# EAGLE design MODULO_LEDS (EAGLE 7.5.0)
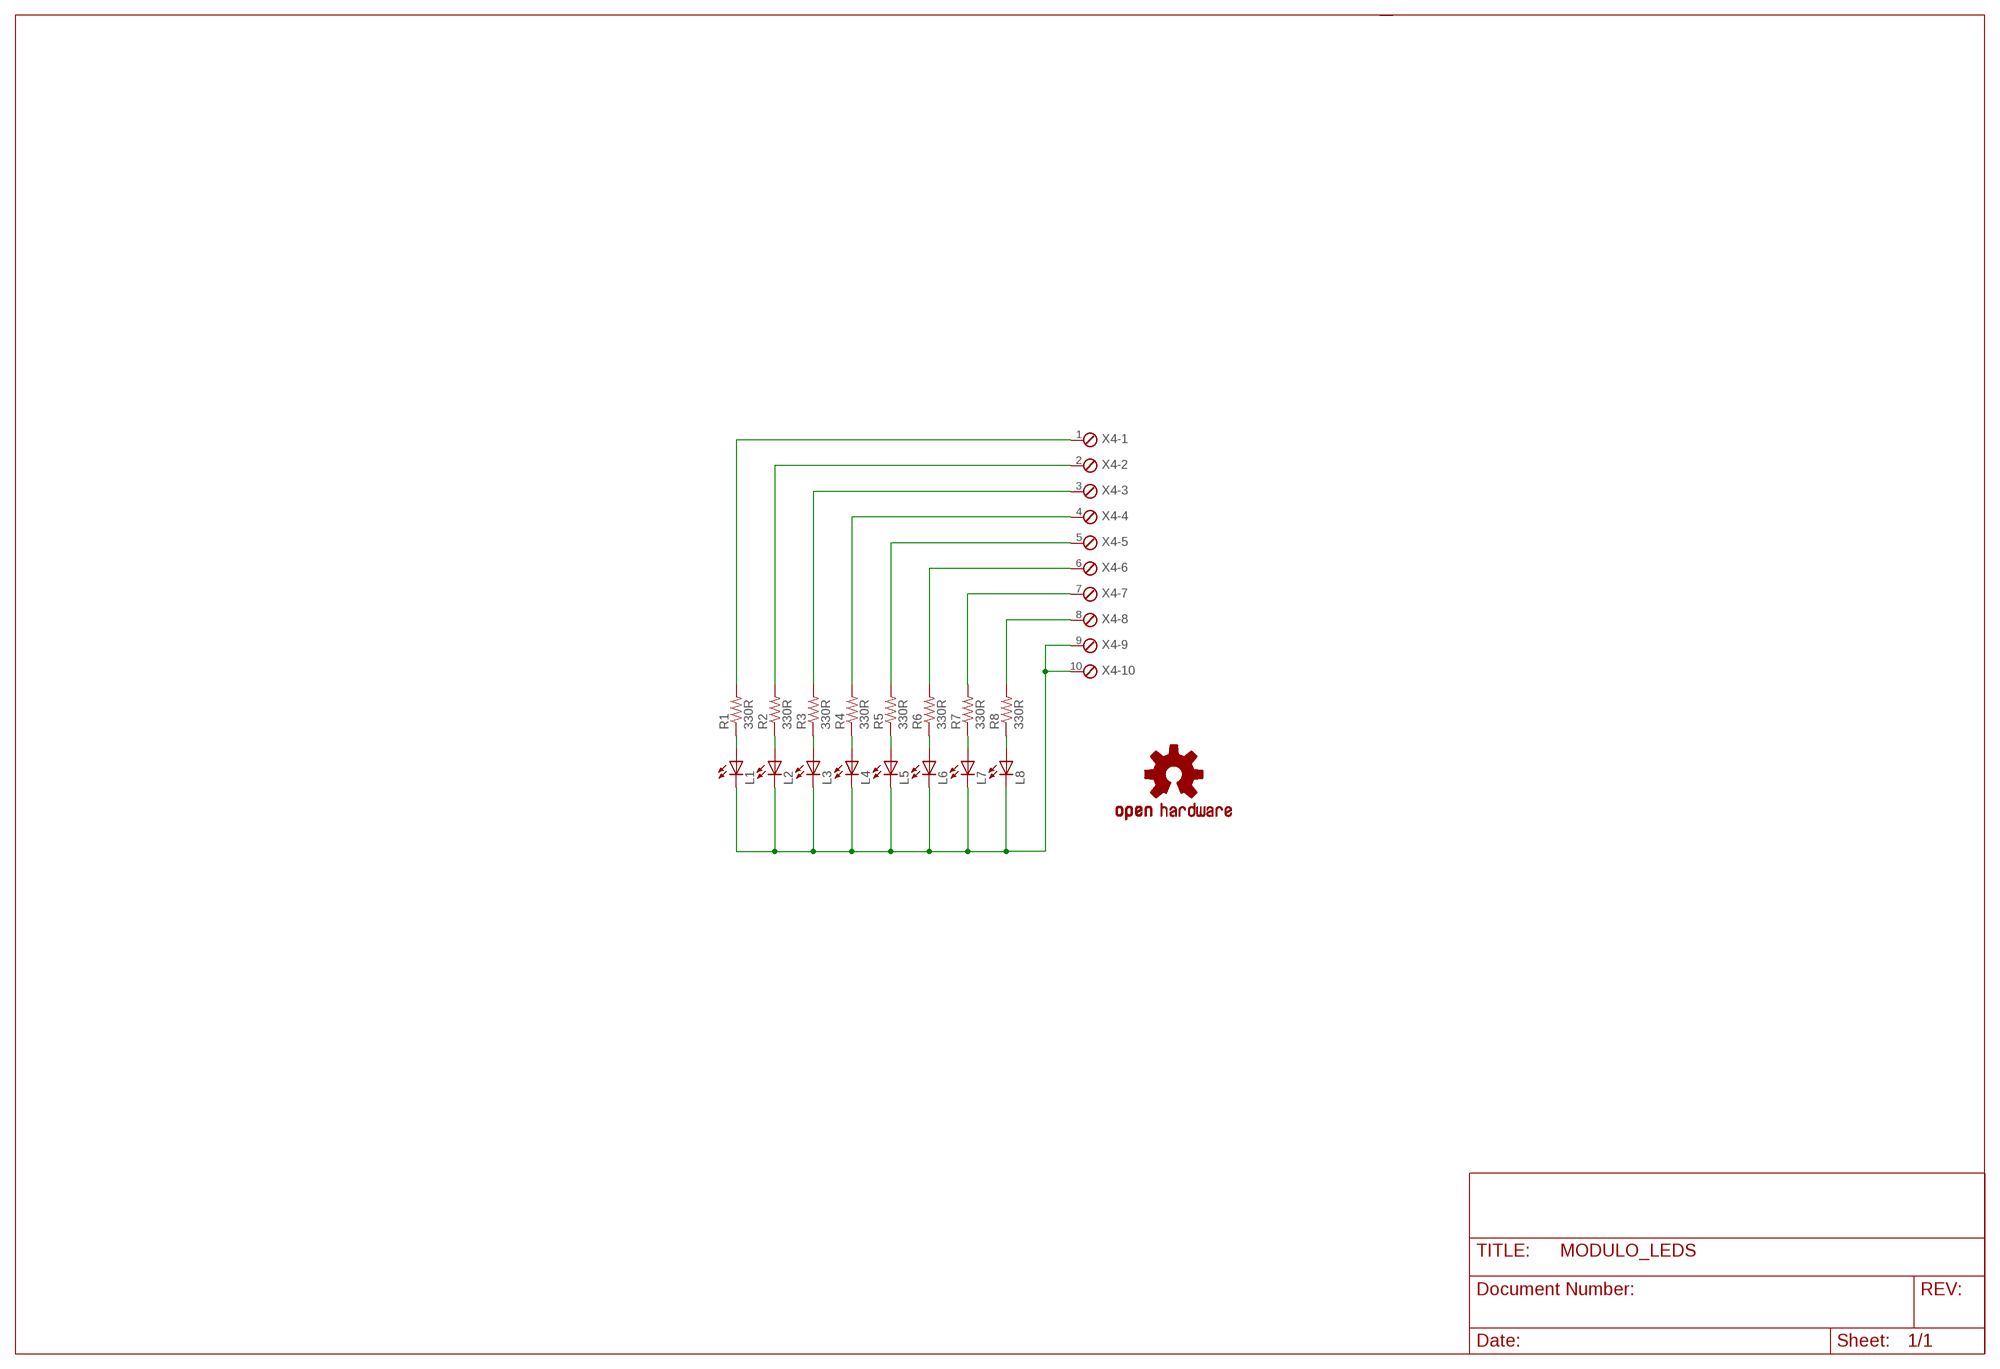
[diagram p0: schematic, sheet 1]

## Parts
L1  LED3MM  [LED3MM]
L2  LED3MM  [LED3MM]
L3  LED3MM  [LED3MM]
L4  LED3MM  [LED3MM]
L5  LED3MM  [LED3MM]
L6  LED3MM  [LED3MM]
L7  LED3MM  [LED3MM]
L8  LED3MM  [LED3MM]
LOGO1  OSHW-LOGOM  [OSHW-LOGO-M]
R1  330R  RESISTORPTH-1/4W  [AXIAL-0.4]
R2  330R  RESISTORPTH-1/4W  [AXIAL-0.4]
R3  330R  RESISTORPTH-1/4W  [AXIAL-0.4]
R4  330R  RESISTORPTH-1/4W  [AXIAL-0.4]
R5  330R  RESISTORPTH-1/4W  [AXIAL-0.4]
R6  330R  RESISTORPTH-1/4W  [AXIAL-0.4]
R7  330R  RESISTORPTH-1/4W  [AXIAL-0.4]
R8  330R  RESISTORPTH-1/4W  [AXIAL-0.4]
X4  MPT10  [10POL254]

## Nets
N$5: L1.A R1.P$1
N$6: L2.A R2.P$1
N$7: L3.A R3.P$1
N$8: L4.A R4.P$1
N$11: L1.K(C) L2.K(C) L3.K(C) L4.K(C) L5.K(C) L6.K(C) L7.K(C) L8.K(C) X4.9 X4.10
N$12: L5.A R5.P$1
N$13: L6.A R6.P$1
N$14: L7.A R7.P$1
N$15: L8.A R8.P$1
N$18: R1.P$2 X4.1
N$20: R2.P$2 X4.2
N$21: R3.P$2 X4.3
N$22: R4.P$2 X4.4
N$23: R5.P$2 X4.5
N$24: R6.P$2 X4.6
N$25: R7.P$2 X4.7
N$26: R8.P$2 X4.8

## Library data of the parts
L1-L8 = led:LED: LED OSRAM: - CHIPLED LG R971, LG N971, LY N971, LG Q971, LY Q971, LO R971, LY R971 LH N974, LH R974 LS Q976, LO Q976, LY Q976 LO Q996 - Hyper CHIPLED LW Q18S LB Q993, LB Q99A, LB R99A - SideLED LS A670, LO A670, LY A670, LG A670, LP A670 LB A673, LV A673, LT A673, LW A673 LH A674 LY A675 LS A676, LA A676, LO A676, LY A676, LW A676 LS A679, LY A679, LG A679 - Hyper Micro SIDELED® LS Y876, LA Y876, LO Y876, LY Y876 LT Y87S - SmartLED LW L88C, LW L88S LB L89C, LB L89S, LG L890 LS L89K, LO L89K, LY L89K LS L896, LA L896, LO L896, LY L896 - TOPLED LS T670, LO T670, LY T670, LG T670, LP T670 LSG T670, LSP T670, LSY T670, LOP T670, LYG T670 LG T671, LOG T671, LSG T671 LB T673, LV T673, LT T673, LW T673 LH T674 LS T676, LA T676, LO T676, LY T676, LB T676, LH T676, LSB T676, LW T676 LB T67C, LV T67C, LT T67C, LS T67K, LO T67K, LY T67K, LW E67C LS E67B, LA E67B, LO E67B, LY E67B, LB E67C, LV E67C, LT E67C LW T67C LS T679, LY T679, LG T679 LS T770, LO T770, LY T770, LG T770, LP T770 LB T773, LV T773, LT T773, LW T773 LH T774 LS E675, LA E675, LY E675, LS T675 LS T776, LA T776, LO T776, LY T776, LB T776 LHGB T686 LT T68C, LB T68C - Hyper Mini TOPLED® LB M676 - Mini TOPLED Santana® LG M470 LS M47K, LO M47K, LY M47K Source: http://www.osram.convergy.de LUXEON: - LUMILED® LXK2-PW12-R00, LXK2-PW12-S00, LXK2-PW14-U00, LXK2-PW14-V00 LXK2-PM12-R00, LXK2-PM12-S00, LXK2-PM14-U00 LXK2-PE12-Q00, LXK2-PE12-R00, LXK2-PE12-S00, LXK2-PE14-T00, LXK2-PE14-U00 LXK2-PB12-K00, LXK2-PB12-L00, LXK2-PB12-M00, LXK2-PB14-N00, LXK2-PB14-P00, LXK2-PB14-Q00 LXK2-PR12-L00, LXK2-PR12-M00, LXK2-PR14-Q00, LXK2-PR14-R00 LXK2-PD12-Q00, LXK2-PD12-R00, LXK2-PD12-S00 LXK2-PH12-R00, LXK2-PH12-S00 LXK2-PL12-P00, LXK2-PL12-Q00, LXK2-PL12-R00 Source: www.luxeon.com KINGBRIGHT: KA-3528ASYC Source: www.kingbright.com
LOGO1 = SparkFun-Aesthetics:OSHW-LOGO: Open Source Hardware Logo This logo indicates the piece of hardware it is found on incorporates a OSHW license and/or adheres to the definition of open source hardware found here: http://freedomdefined.org/OSHW
R1-R8 = SparkFun:RESISTOR: Resistor Basic schematic elements and footprints for 0603, 1206, and PTH resistors.
X4 = con-phoenix-254:MPT10: PHOENIX CONNECTOR; OC_FARNELL: unknown; OC_NEWARK: unknown

## Board
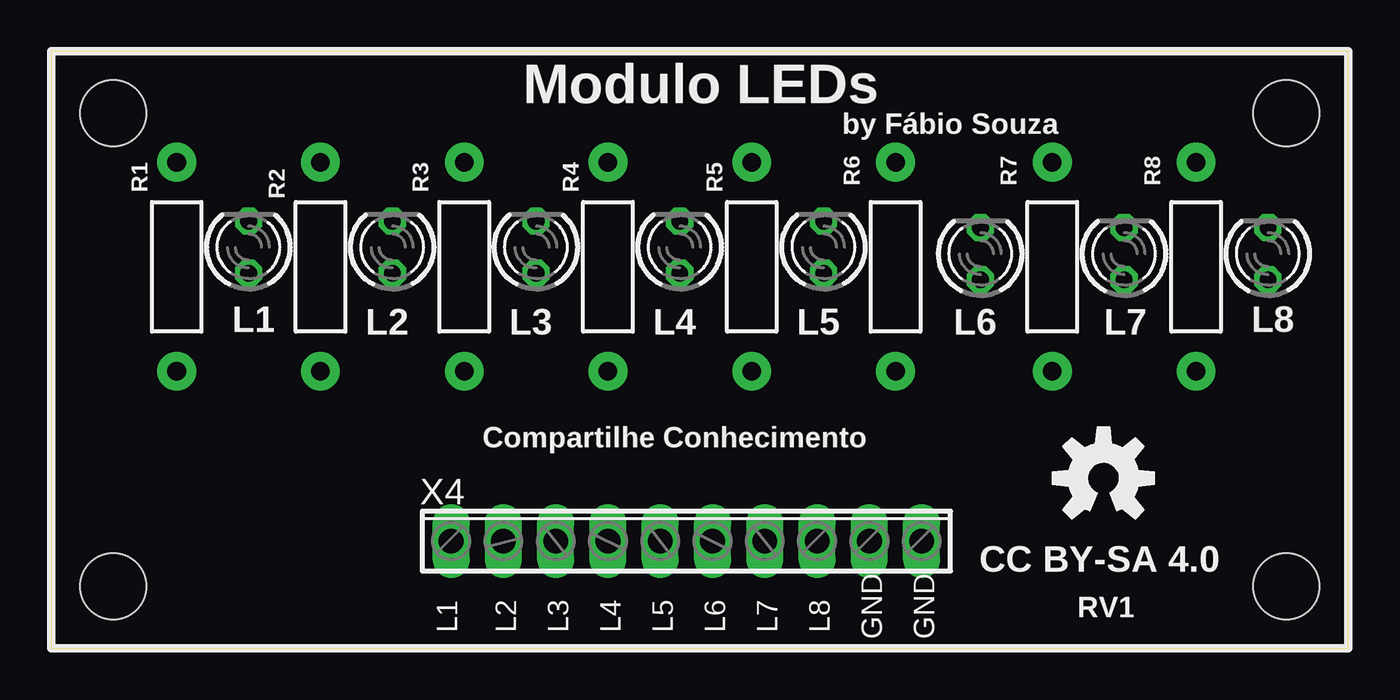
[diagram p1: board, top side]
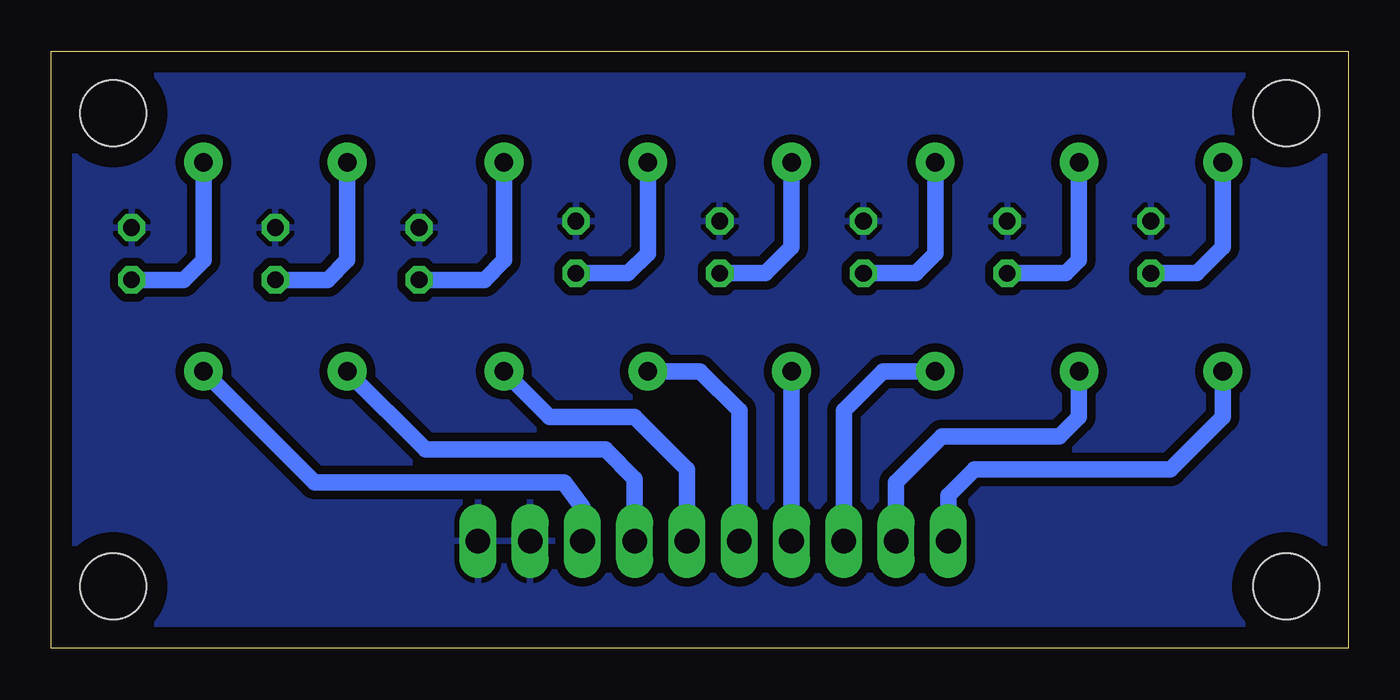
[diagram p2: board, bottom side, seen from below]

Size 63 x 29 mm. Coordinates in mm from the lower left corner, seen from the top.
Outline: 63,29 0,29 0,0 63,0 63,29
Copper layers (1*16): Top 0.035mm / dielectric 1.5mm / Bottom 0.035mm
Design rules "default": minimum track width 10mil, minimum drill 24mil, track to track 8mil, track to pad 8mil, pad to pad 8mil, via to via 8mil, smd to smd 8mil, copper to edge 40mil, drill to drill 8mil, minimum pad ring 10mil, minimum via ring 8mil, stop-mask expansion 4mil, vias tented up to drill 0mil, thermal gap 10mil
Holes 3.2 mm at 60,3 60,26 3,26 3,3

### Footprints (pad centres in the part's own frame; a part is rotated, then mirrored left to right if it is on the bottom)
LED3MM = drill 0.813 octagon: A -1.27,0; K 1.27,0
AXIAL-0.4 = drill 0.9 pad 1.88: P$1 -5.08,0; P$2 5.08,0
10POL254 = drill 1.2 long: 1 -11.43,0; 2 -8.89,0; 3 -6.35,0; 4 -3.81,0; 5 -1.27,0; 6 1.27,0; 7 3.81,0; 8 6.35,0; 9 8.89,0; 10 11.43,0

### Placement (x,y rotation side)
L1  9.58,19.49 90 top
L2  16.56,19.49 90 top
L3  23.55,19.49 90 top
L4  30.53,19.49 90 top
L5  37.52,19.49 90 top
L6  45.14,19.17 90 top
L7  52.12,19.17 90 top
L8  59.11,19.17 90 top
LOGO1  51.12,8.26 0 top
R1  6.08,18.54 270 top
R2  13.07,18.54 270 top
R3  20.05,18.54 270 top
R4  27.04,18.54 270 top
R5  34.02,18.54 270 top
R6  41.01,18.54 270 top
R7  48.63,18.54 270 top
R8  55.62,18.54 270 top
X4  30.85,5.2 0 top

### Tracks (layer width: path | path; a pad name or v marks a point on that pad's centre or on a via)
N$5
  Bottom 0.813: L1.A 7.36,18.22 6.08,19.49 R1.P$1
N$6
  Bottom 0.813: L2.A 13.71,18.22 13.07,18.85 R2.P$1
N$7
  Bottom 0.813: L3.A 21.01,18.22 20.05,19.17 R3.P$1
N$8
  Bottom 0.813: L4.A 28.31,18.22 27.04,19.49 R4.P$1
N$11
  pour Bottom (isolate 0.406): 62.6,28.7 0.37,28.7 0.37,0.12 62.92,0.44
N$12
  Bottom 0.813: L5.A 34.98,18.22 34.02,19.17 R5.P$1
N$13
  Bottom 0.813: L6.A 41.96,17.9 41.01,18.85 R6.P$1
N$14
  Bottom 0.813: L7.A 49.58,17.9 48.63,18.85 R7.P$1
N$15
  Bottom 0.813: L8.A 56.57,17.9 55.62,18.85 R8.P$1
N$18
  Bottom 0.813: X4.1 19.42,7.42 18.15,8.69 8.62,8.69 6.08,11.23 R1.P$2
N$20
  Bottom 0.813: X4.2 21.96,8.06 19.74,10.28 14.02,10.28 13.07,11.23 R2.P$2
N$21
  Bottom 0.813: X4.3 24.5,11.55 22.59,13.46 R3.P$2
N$22
  Bottom 0.813: R4.P$2 X4.4
N$23
  Bottom 0.813: X4.5 29.58,11.55 31.48,13.46 R5.P$2
N$24
  Bottom 0.813: X4.6 32.12,8.69 34.66,11.23 38.79,11.23 R6.P$2
N$25
  Bottom 0.813: X4.7 34.66,8.22 36.08,9.64 44.82,9.64 R7.P$2
N$26
  Bottom 0.813: X4.8 37.2,6.84 38.1,8.06 50.22,8.06 R8.P$2

### Text on the board
tPlace: Modulo LEDs | by Fábio Souza | Compartilhe Conhecimento | CC BY-SA 4.0 | L1 | L2 | L3 | L4 | L5 | L6 | L7 | L8 | RV1 | GND | GND